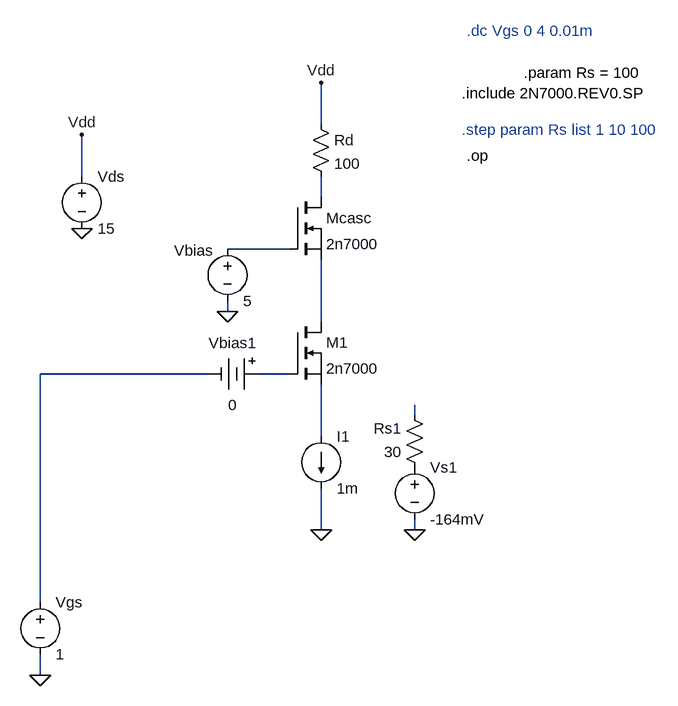
[diagram p0: schematic mosfet+cascodo+fte cte.asc]
mosfet+cascodo+fte cte.asc, the LTspice schematic file:
Version 4
SHEET 1 928 704
WIRE 208 -160 208 -224
WIRE -160 -80 -160 -144
WIRE 208 -48 208 -80
WIRE 160 32 64 32
WIRE 64 128 64 112
WIRE 208 144 208 48
WIRE 32 224 -224 224
WIRE 160 224 112 224
WIRE 352 288 352 272
WIRE 208 320 208 240
WIRE 208 464 208 400
WIRE 352 464 352 448
WIRE -224 576 -224 224
WIRE -224 688 -224 656
FLAG -224 688 0
FLAG -160 0 0
FLAG 208 464 0
FLAG -160 -144 Vdd
FLAG 208 -224 Vdd
FLAG 352 464 0
FLAG 64 128 0
SYMBOL nmos 160 144 R0
SYMATTR InstName M1
SYMATTR Value 2n7000
SYMATTR Prefix X
SYMBOL voltage -224 560 R0
WINDOW 123 0 0 Left 2
WINDOW 39 0 0 Left 2
SYMATTR InstName Vgs
SYMATTR Value 1
SYMBOL voltage -160 -96 R0
WINDOW 123 0 0 Left 2
WINDOW 39 0 0 Left 2
SYMATTR InstName Vds
SYMATTR Value 15
SYMBOL res 368 384 R180
WINDOW 0 36 76 Left 2
WINDOW 3 36 40 Left 2
SYMATTR InstName Rs1
SYMATTR Value 30
SYMBOL res 192 -176 R0
SYMATTR InstName Rd
SYMATTR Value 100
SYMBOL current 208 320 R0
WINDOW 123 0 0 Left 2
WINDOW 39 0 0 Left 2
SYMATTR InstName I1
SYMATTR Value 1m
SYMBOL voltage 352 352 R0
WINDOW 123 0 0 Left 2
WINDOW 39 0 0 Left 2
SYMATTR InstName Vs1
SYMATTR Value -164mV
SYMBOL nmos 160 -48 R0
SYMATTR InstName Mcasc
SYMATTR Value 2n7000
SYMATTR Prefix X
SYMBOL voltage 64 16 R0
WINDOW 0 -82 18 Left 2
WINDOW 123 0 0 Left 2
WINDOW 39 0 0 Left 2
SYMATTR InstName Vbias
SYMATTR Value 5
SYMBOL battery 128 224 R90
WINDOW 0 -32 56 VBottom 2
WINDOW 3 32 56 VTop 2
SYMATTR InstName Vbias1
SYMATTR Value 0
TEXT 432 -304 Left 2 ;.dc Vgs 0 4 0.01m
TEXT 520 -240 Left 2 !.param Rs = 100
TEXT 424 -152 Left 2 ;.step param Rs list 1 10 100
TEXT 424 -208 Left 2 !.include 2N7000.REV0.SP
TEXT 432 -112 Left 2 !.op

The netlist it stands for:
* mosfet+cascodo+fte cte.asc
XM1 N003 N005 N007 2n7000  ; pins D G S
Vgs N004 0 1
Vds Vdd 0 15
Rs1 P001 N006 30
Rd Vdd N001 100
I1 N007 0 1m
Vs1 P001 0 -164mV
XMcasc N001 N002 N003 2n7000  ; pins D G S
Vbias N002 0 5
Vbias1 N005 N004 0
* .dc Vgs 0 4 0.01m
.param Rs = 100
* .step param Rs list 1 10 100
.include 2N7000.REV0.SP
.op
.backanno
.end